# EAGLE design DriverBoard (EAGLE 7.5.0)
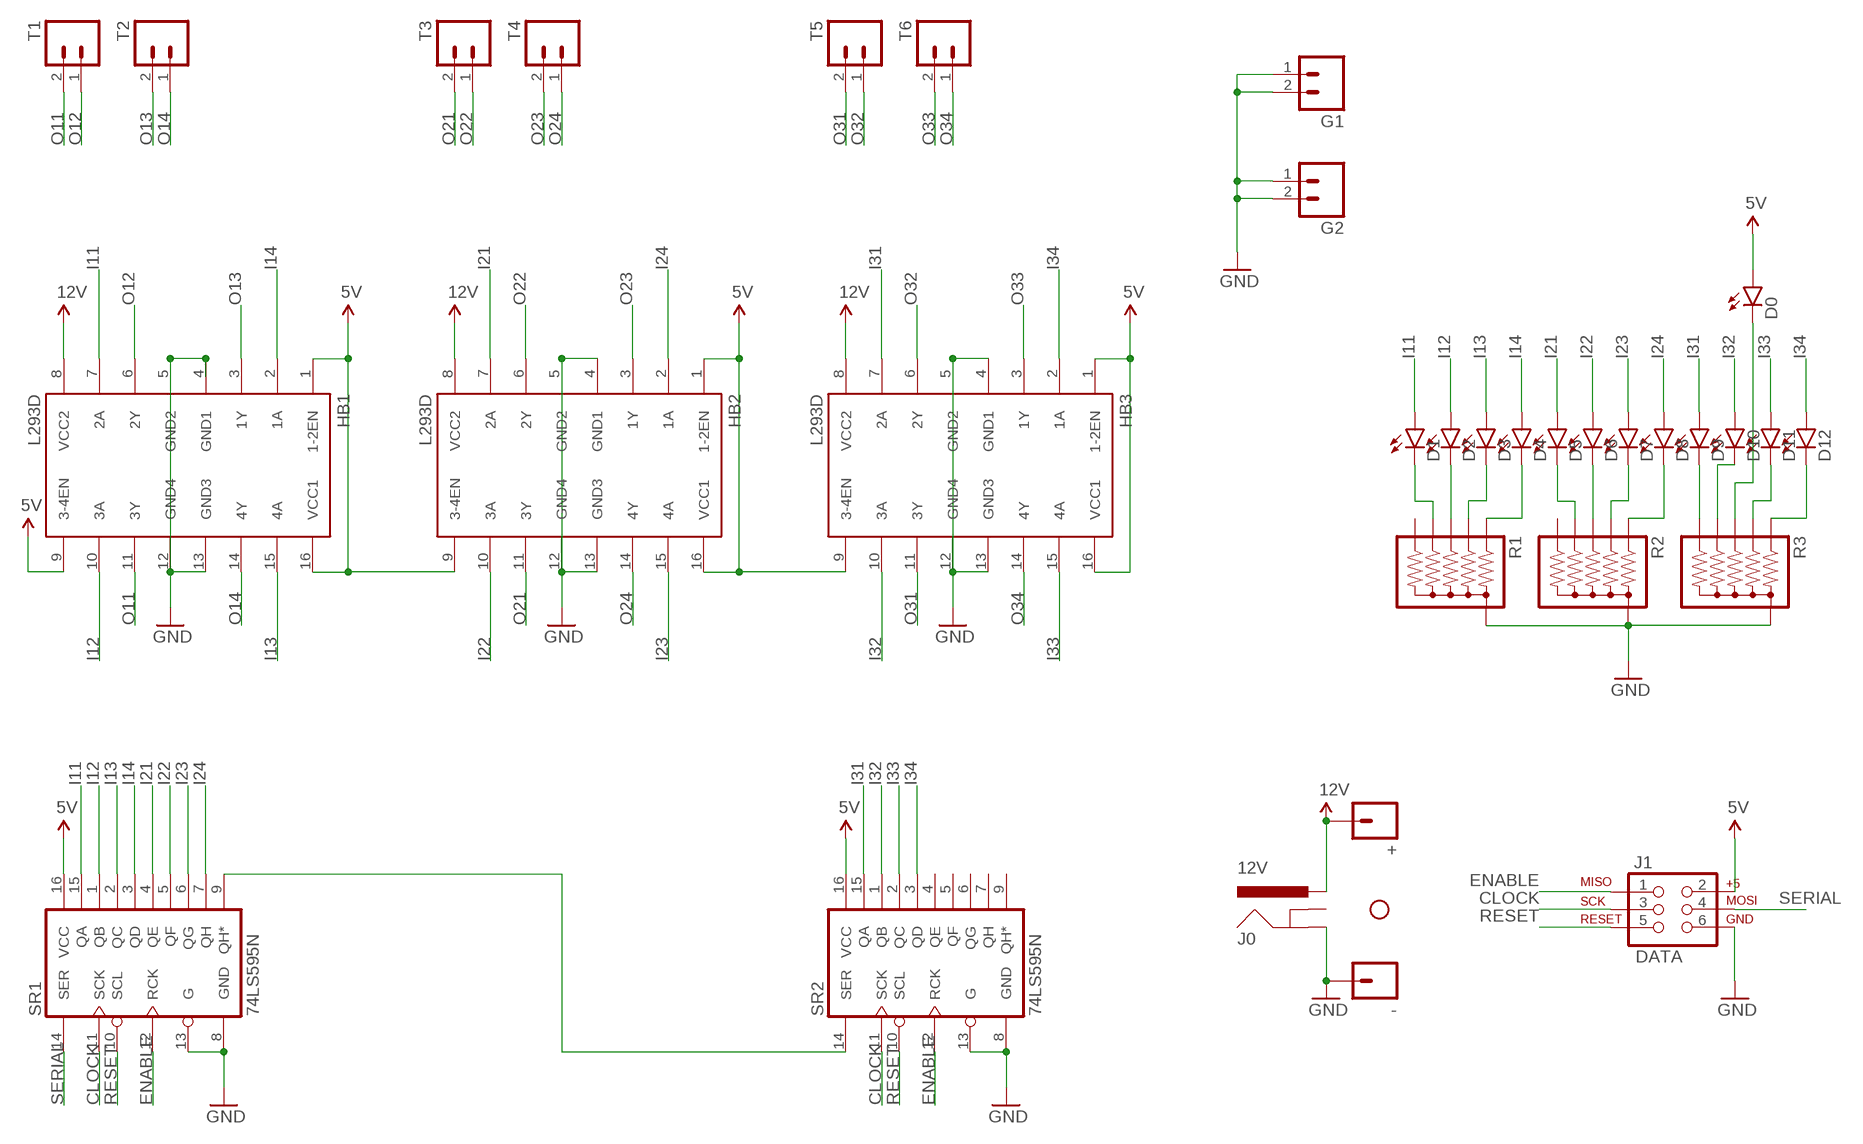
[diagram p0: schematic, sheet 1]

## Parts
+  M01PTH_NO_SILK_YES_STOP  [1X01_NO_SILK]
-  M01PTH_NO_SILK_YES_STOP  [1X01_NO_SILK]
D0  LED5MM  [LED5MM]
D1  LED5MM  [LED5MM]
D2  LED5MM  [LED5MM]
D3  LED5MM  [LED5MM]
D4  LED5MM  [LED5MM]
D5  LED5MM  [LED5MM]
D6  LED5MM  [LED5MM]
D7  LED5MM  [LED5MM]
D8  LED5MM  [LED5MM]
D9  LED5MM  [LED5MM]
D10  LED5MM  [LED5MM]
D11  LED5MM  [LED5MM]
D12  LED5MM  [LED5MM]
G1  M025MM  [SCREWTERMINAL-5MM-2]
G2  M025MM  [SCREWTERMINAL-5MM-2]
H1  STAND-OFF  [STAND-OFF]
HB1  L293D  [DIL16]
HB2  L293D  [DIL16]
HB3  L293D  [DIL16]
J0  12V  POWER_JACKPTH_BREAD  [POWER_JACK_PTH_BREAD]
J1  DATA  AVR_SPI_PRG_6PTH  [2X3]
R1  RPACK-BUSSED-5-SIP-PTH-5  [RPACK-SIP-PTH-5]
R2  RPACK-BUSSED-5-SIP-PTH-5  [RPACK-SIP-PTH-5]
R3  RPACK-BUSSED-5-SIP-PTH-5  [RPACK-SIP-PTH-5]
SR1  74LS595N  [DIL16]
SR2  74LS595N  [DIL16]
T1  M025MM  [SCREWTERMINAL-5MM-2]
T2  M025MM  [SCREWTERMINAL-5MM-2]
T3  M025MM  [SCREWTERMINAL-5MM-2]
T4  M025MM  [SCREWTERMINAL-5MM-2]
T5  M025MM  [SCREWTERMINAL-5MM-2]
T6  M025MM  [SCREWTERMINAL-5MM-2]

## Nets
5V: D0.A HB1.1(1-2EN) HB1.9(3-4EN) HB1.16(VCC1) HB2.1(1-2EN) HB2.9(3-4EN) HB2.16(VCC1) HB3.1(1-2EN) HB3.9(3-4EN) HB3.16(VCC1) J1.2 SR1.16(VCC) SR2.16(VCC)
12V: +.1 HB1.8(VCC2) HB2.8(VCC2) HB3.8(VCC2) J0.PWR
CLOCK: J1.3 SR1.11(SCK) SR2.11(SCK)
ENABLE: J1.1 SR1.12(RCK) SR2.12(RCK)
GND: -.1 G1.1 G1.2 G2.1 G2.2 HB1.4(GND1) HB1.5(GND2) HB1.12(GND4) HB1.13(GND3) HB2.4(GND1) HB2.5(GND2) HB2.12(GND4) HB2.13(GND3) HB3.4(GND1) HB3.5(GND2) HB3.12(GND4) HB3.13(GND3) J0.GND J1.6 R1.P$1 R2.P$1 R3.P$1 SR1.8(GND) SR1.13(G) SR2.8(GND) SR2.13(G)
I11: D1.A HB1.7(2A) SR1.15(QA)
I12: D2.A HB1.10(3A) SR1.1(QB)
I13: D3.A HB1.15(4A) SR1.2(QC)
I14: D4.A HB1.2(1A) SR1.3(QD)
I21: D5.A HB2.7(2A) SR1.4(QE)
I22: D6.A HB2.10(3A) SR1.5(QF)
I23: D7.A HB2.15(4A) SR1.6(QG)
I24: D8.A HB2.2(1A) SR1.7(QH)
I31: D9.A HB3.7(2A) SR2.15(QA)
I32: D10.A HB3.10(3A) SR2.1(QB)
I33: D11.A HB3.15(4A) SR2.2(QC)
I34: D12.A HB3.2(1A) SR2.3(QD)
N$1: D10.K(C) R3.P$5
N$2: D0.K(C) R3.P$4
N$38: D4.K(C) R1.P$2
N$39: D3.K(C) R1.P$3
N$40: D2.K(C) R1.P$4
N$41: D1.K(C) R1.P$5
N$42: D8.K(C) R2.P$2
N$43: D7.K(C) R2.P$3
N$44: D6.K(C) R2.P$4
N$45: D5.K(C) R2.P$5
N$46: D12.K(C) R3.P$2
N$47: D11.K(C) R3.P$3
N$49: D9.K(C) R3.P$6
N$62: SR1.9(QH*) SR2.14(SER)
O11: HB1.11(3Y) T1.2
O12: HB1.6(2Y) T1.1
O13: HB1.3(1Y) T2.2
O14: HB1.14(4Y) T2.1
O21: HB2.11(3Y) T3.2
O22: HB2.6(2Y) T3.1
O23: HB2.3(1Y) T4.2
O24: HB2.14(4Y) T4.1
O31: HB3.11(3Y) T5.2
O32: HB3.6(2Y) T5.1
O33: HB3.3(1Y) T6.2
O34: HB3.14(4Y) T6.1
RESET: J1.5 SR1.10(SCL) SR2.10(SCL)
SERIAL: J1.4 SR1.14(SER)
Unconnected: J0.GNDBREAK R1.P$6 R2.P$6 SR2.4(QE) SR2.5(QF) SR2.6(QG) SR2.7(QH) SR2.9(QH*)

## Library data of the parts
+ - = SparkFun-Connectors:M01: Header 1 Standard 1-pin 0.1" header. Use with straight break away headers (SKU : PRT-00116), right angle break away headers (PRT-00553), swiss pins (PRT-00743), machine pins (PRT-00117), and female headers (PRT-00115). SMTSO-256-ET is a "flush mount" nut for a 4-40 screw. The older package used to be too tight, and did not allow it to sit properly thru the drill hit. The latest (0.165DIA) fits nice and snug.
D0 D1-D12 = SparkFun-LED:LED: LEDs Standard schematic elements and footprints for 5mm, 3mm, 1206, and 0603 sized LEDs. 5mm - Spark Fun Electronics SKU : COM-00529 (and others)
G1 G2 T1-T6 = SparkFun-Connectors:M02: Standard 2-pin 0.1" header. Use with - straight break away headers ( PRT-00116) - right angle break away headers (PRT-00553) - swiss pins (PRT-00743) - machine pins (PRT-00117) - female headers (PRT-00115) Molex polarized connector foot print use with: PRT-08233 with associated crimp pins and housings. 2.54_SCREWTERM for use with PRT-10571. 3.5mm Screw Terminal footprints for PRT-08084 5mm Screw Terminal footprints for use with PRT-08432; STOREFRONT_ID: PRT-08432
H1 = SparkFun-Electromechanical:STAND-OFF: #4 Stand Off This is the mechanical footprint for a #4 phillips button head screw. Use the keepout ring to avoid running the screw head into surrounding components. SKU : PRT-00447
HB1-HB3 = st-microelectronics:L293D: PUSH-PULL 4 CHANNEL DRIVER; MPN: L293D; OC_FARNELL: 9589619; OC_NEWARK: 56P8249
J0 = SparkFun-Connectors:POWER_JACK: Power Jack This is the standard 5.5mm barrel jack for power. The PTH is the most common, proven, reliable, footprint. The Slot footprint only works if the mill layer is transmitted to the PCB fab house so be warned. Mating wall wart : TOL-00298 (and others); PROD_ID: PRT-10811
J1 = SparkFun-Connectors:AVR_SPI_PRG_6: AVR ISP 6 Pin This is the reduced ISP connector for AVR programming. Common on Arduino. This footprint will take up less PCB space and can be used with a 10-pin to 6-pin adapter such as SKU: BOB-08508 **Special note about "TEST_POINT" package. The stop mask is on the top side, so if you want your programming test points to be on the bottom of your board, make sure to place this package on the bottom side of the board. This also ensure that the orientation to program from the bottom side will be correct.
R1-R3 = SparkFun-Resistors:RPACK-BUSSED-5: BOURNS 4600X series thick-film SIP resistor packs Five resistors bussed to a single pin (denoted by dot). 0.2W / resistor datasheet <http://dlnmh9ip6v2uc.cloudfront.net/datasheets/Components/General/4600x.pdf> SFE parts COM-10855 (330), COM-10856 (10K)
SR1 SR2 = SparkFun-DigitalIC:74*595: 8-bit SHIFT REGISTER, output latch

## Board
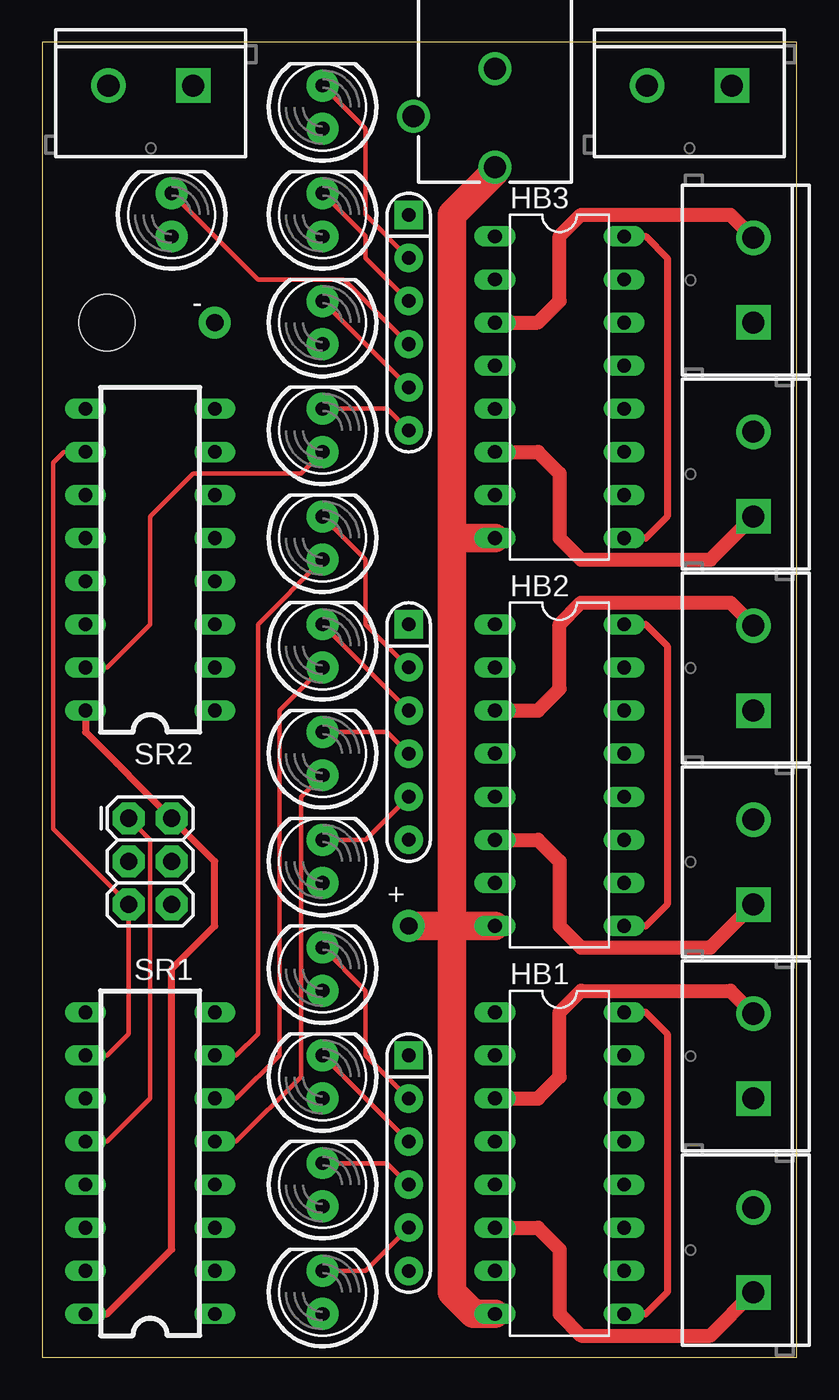
[diagram p1: board, top side]
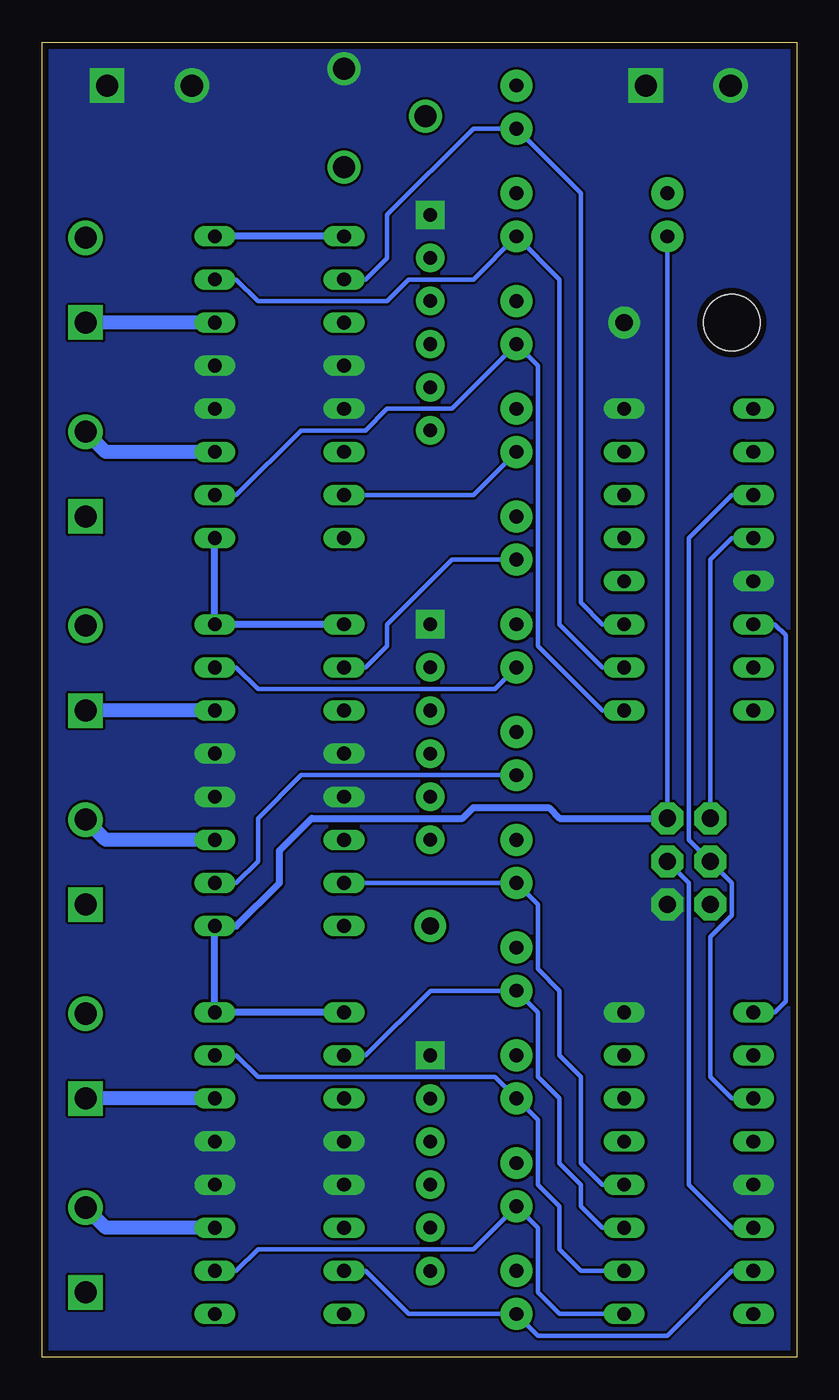
[diagram p2: board, bottom side, seen from below]

Size 44.45 x 77.47 mm. Coordinates in mm from the lower left corner, seen from the top.
Outline: 0,0 44.45,0 44.45,77.47 0,77.47 0,0
Copper layers (1*16): Top 0.0356mm / dielectric 1.5011mm / Bottom 0.0356mm
Design rules "LaenPCBOrder": minimum track width 6mil, minimum drill 13mil, track to track 6mil, track to pad 6mil, pad to pad 6mil, via to via 6mil, smd to smd 6mil, copper to edge 15mil, drill to drill 6mil, minimum pad ring 7mil, minimum via ring 7mil, stop-mask expansion 3mil, vias tented up to drill 0mil, thermal gap 10mil

### Footprints (pad centres in the part's own frame; a part is rotated, then mirrored left to right if it is on the bottom)
1X01_NO_SILK = drill 1.016 pad 1.88: 1 0,0
LED5MM = drill 0.813 pad 1.88: A -1.27,0; K 1.27,0
SCREWTERMINAL-5MM-2 = drill 1.3 pad 2.032 square: 1 0,0 | drill 1.3 pad 2.032: 2 5,0
STAND-OFF = hole 3.302: 0,0
DIL16 = drill 0.813 long: 1 -8.89,-3.81; 2 -6.35,-3.81; 3 -3.81,-3.81; 4 -1.27,-3.81; 5 1.27,-3.81; 6 3.81,-3.81; 7 6.35,-3.81; 8 8.89,-3.81; 9 8.89,3.81; 10 6.35,3.81; 11 3.81,3.81; 12 1.27,3.81; 13 -1.27,3.81; 14 -3.81,3.81; 15 -6.35,3.81; 16 -8.89,3.81
POWER_JACK_PTH_BREAD = drill 1.3: GND 0,7.9; GNDBREAK 4.8,10.7; PWR 0,13.7
2X3 = drill 1.016 pad 1.88 octagon: 1 0,0; 2 0,2.54; 3 2.54,0; 4 2.54,2.54; 5 5.08,0; 6 5.08,2.54
RPACK-SIP-PTH-5 = drill 0.8 pad 1.676 square: P$1 0,0 | drill 0.8 pad 1.676: P$2 0,-2.54; P$3 0,-5.08; P$4 0,-7.62; P$5 0,-10.16; P$6 0,-12.7

### Placement (x,y rotation side)
+  21.59,25.4 0 top
-  10.16,60.96 0 top
D0  7.62,67.31 90 top
D1  16.51,3.81 90 top
D2  16.51,10.16 90 top
D3  16.51,16.51 90 top
D4  16.51,22.86 90 top
D5  16.51,29.21 90 top
D6  16.51,35.56 90 top
D7  16.51,41.91 90 top
D8  16.51,48.26 90 top
D9  16.51,54.61 90 top
D10  16.51,60.96 90 top
D11  16.51,67.31 90 top
D12  16.51,73.66 90 top
G1  40.64,74.93 180 top
G2  8.89,74.93 180 top
H1  3.81,60.96 0 top
HB1  30.48,11.43 270 top
HB2  30.48,34.29 270 top
HB3  30.48,57.15 270 top
J0  26.67,83.82 180 top
J1  5.08,31.75 270 top
R1  21.59,17.78 0 top
R2  21.59,43.18 0 top
R3  21.59,67.31 0 top
SR1  6.35,11.43 90 top
SR2  6.35,46.99 90 top
T1  41.91,3.81 90 top
T2  41.91,15.24 90 top
T3  41.91,26.67 90 top
T4  41.91,38.1 90 top
T5  41.91,49.53 90 top
T6  41.91,60.96 90 top

### Tracks (layer width: path | path; a pad name or v marks a point on that pad's centre or on a via)
5V
  Top 0.406: HB3.16 35.56,66.04 36.83,64.77 36.83,49.53 35.56,48.26 HB3.9 | HB2.16 35.56,43.18 36.83,41.91 36.83,26.67 35.56,25.4 HB2.9 | SR1.16 3.81,2.54 7.62,6.35 7.62,22.86 10.16,25.4 10.16,29.21 J1.2 2.54,36.83 SR2.16 | HB1.9 35.56,2.54 36.83,3.81 36.83,19.05 35.56,20.32 HB1.16
  Bottom 0.254: D0.A J1.2
  Bottom 0.406: HB1.1 HB1.16 HB2.9 33.02,25.4 30.48,27.94 30.48,29.84 28.57,31.75 19.68,31.75 19.05,32.38 14.61,32.38 13.97,31.75 J1.2 | HB2.1 HB2.16 HB3.9 | HB3.1 HB3.16
12V
  Top 1.676: J0.PWR 26.67,69.85 24.13,67.31 24.13,48.26 | 24.13,48.26 24.13,25.4 | 24.13,25.4 24.13,3.81 25.4,2.54 HB1.8 | HB2.8 24.13,25.4 | HB3.8 24.13,48.26 | 24.13,25.4 +.1
CLOCK
  Bottom 0.254: SR2.11 3.81,50.8 6.35,48.26 6.35,30.48 J1.3 3.81,27.94 3.81,26.04 5.08,24.77 5.08,16.51 3.81,15.24 SR1.11
ENABLE
  Top 0.254: SR1.12 3.81,12.7 6.35,15.24 6.35,30.48 J1.1
  Bottom 0.254: SR2.12 3.81,48.26 5.08,46.99 J1.1
GND
  pour Bottom (no thermals): 0,77.47 44.45,77.47 44.45,0 0,0
I11
  Bottom 0.254: SR1.15 3.81,5.08 7.62,1.27 15.24,1.27 D1.A 22.86,2.54 25.4,5.08 HB1.7
I12
  Bottom 0.254: SR1.1 13.97,2.54 15.24,3.81 15.24,7.62 D2.A 19.05,6.35 31.75,6.35 33.02,5.08 HB1.10
I13
  Bottom 0.254: SR1.2 12.7,5.08 13.97,6.35 13.97,8.89 15.24,10.16 15.24,13.97 D3.A 17.78,16.51 31.75,16.51 33.02,17.78 HB1.15
I14
  Bottom 0.254: SR1.3 11.43,7.62 12.7,8.89 12.7,10.16 13.97,11.43 13.97,15.24 15.24,16.51 15.24,20.32 D4.A 21.59,21.59 25.4,17.78 HB1.2
I21
  Bottom 0.254: SR1.4 11.43,10.16 12.7,11.43 12.7,16.51 13.97,17.78 13.97,21.59 15.24,22.86 15.24,26.67 D5.A HB2.7
I22
  Top 0.254: SR1.5 11.43,12.7 15.24,16.51 15.24,33.02 D6.A
  Bottom 0.254: D6.A 29.21,34.29 31.75,31.75 31.75,29.21 33.02,27.94 HB2.10
I23
  Top 0.254: SR1.6 11.43,15.24 13.97,17.78 13.97,38.1 D7.A
  Bottom 0.254: D7.A 17.78,39.37 31.75,39.37 33.02,40.64 HB2.15
I24
  Top 0.254: SR1.7 11.43,17.78 12.7,19.05 12.7,43.18 D8.A
  Bottom 0.254: D8.A 20.32,46.99 24.13,43.18 24.13,41.91 25.4,40.64 HB2.2
I31
  Top 0.254: SR2.15 3.81,40.64 6.35,43.18 6.35,49.53 8.89,52.07 15.24,52.07 D9.A
  Bottom 0.254: D9.A 19.05,50.8 HB3.7
I32
  Bottom 0.254: HB3.10 33.02,50.8 29.21,54.61 25.4,54.61 24.13,55.88 20.32,55.88 D10.A 15.24,58.42 15.24,41.91 11.43,38.1 SR2.1
I33
  Bottom 0.254: HB3.15 33.02,63.5 31.75,62.23 24.13,62.23 22.86,63.5 19.05,63.5 D11.A 13.97,63.5 13.97,43.18 11.43,40.64 SR2.2
I34
  Bottom 0.254: HB3.2 25.4,63.5 24.13,64.77 24.13,67.31 19.05,72.39 D12.A 12.7,68.58 12.7,44.45 11.43,43.18 SR2.3
N$1
  Top 0.254: D10.K R3.P$5
N$2
  Top 0.254: R3.P$4 17.78,63.5 12.7,63.5 D0.K
N$38
  Top 0.254: D4.K 19.05,21.59 19.05,17.78 R1.P$2
N$39
  Top 0.254: D3.K R1.P$3
N$40
  Top 0.254: D2.K 20.32,11.43 R1.P$4
N$41
  Top 0.254: D1.K 19.05,5.08 R1.P$5
N$42
  Top 0.254: D8.K 19.05,46.99 19.05,43.18 R2.P$2
N$43
  Top 0.254: D7.K R2.P$3
N$44
  Top 0.254: D6.K 20.32,36.83 R2.P$4
N$45
  Top 0.254: D5.K 19.05,30.48 R2.P$5
N$46
  Top 0.254: D12.K 19.05,72.39 19.05,67.31 R3.P$2
N$47
  Top 0.254: D11.K 19.05,66.04 19.05,64.77 R3.P$3
N$49
  Top 0.254: D9.K 20.32,55.88 R3.P$6
N$62
  Bottom 0.254: SR2.14 1.27,43.18 0.64,42.55 0.64,20.95 1.27,20.32 SR1.9
O11
  Bottom 0.813: HB1.11 40.72,7.62 T1.2
O12
  Top 0.813: HB1.6 29.21,7.62 30.48,6.35 30.48,2.54 31.75,1.27 39.37,1.27 T1.1
O13
  Top 0.813: HB1.3 29.21,15.24 30.48,16.51 30.48,20.32 31.75,21.59 40.56,21.59 T2.2
O14
  Bottom 0.813: HB1.14 T2.1
O21
  Bottom 0.813: HB2.11 40.72,30.48 T3.2
O22
  Top 0.813: HB2.6 29.21,30.48 30.48,29.21 30.48,25.4 31.75,24.13 39.37,24.13 T3.1
O23
  Top 0.813: HB2.3 29.21,38.1 30.48,39.37 30.48,43.18 31.75,44.45 40.56,44.45 T4.2
O24
  Bottom 0.813: HB2.14 T4.1
O31
  Bottom 0.813: HB3.11 40.72,53.34 T5.2
O32
  Top 0.813: HB3.6 29.21,53.34 30.48,52.07 30.48,48.26 31.75,46.99 39.37,46.99 T5.1
O33
  Top 0.813: HB3.3 29.21,60.96 30.48,62.23 30.48,66.04 31.75,67.31 40.56,67.31 T6.2
O34
  Bottom 0.813: HB3.14 T6.1
RESET
  Top 0.254: SR1.10 3.81,17.78 5.08,19.05 J1.5 0.64,31.11 0.64,52.7 1.27,53.34 SR2.10
SERIAL
  Bottom 0.254: SR1.14 3.81,7.62 6.35,10.16 6.35,27.94 J1.4